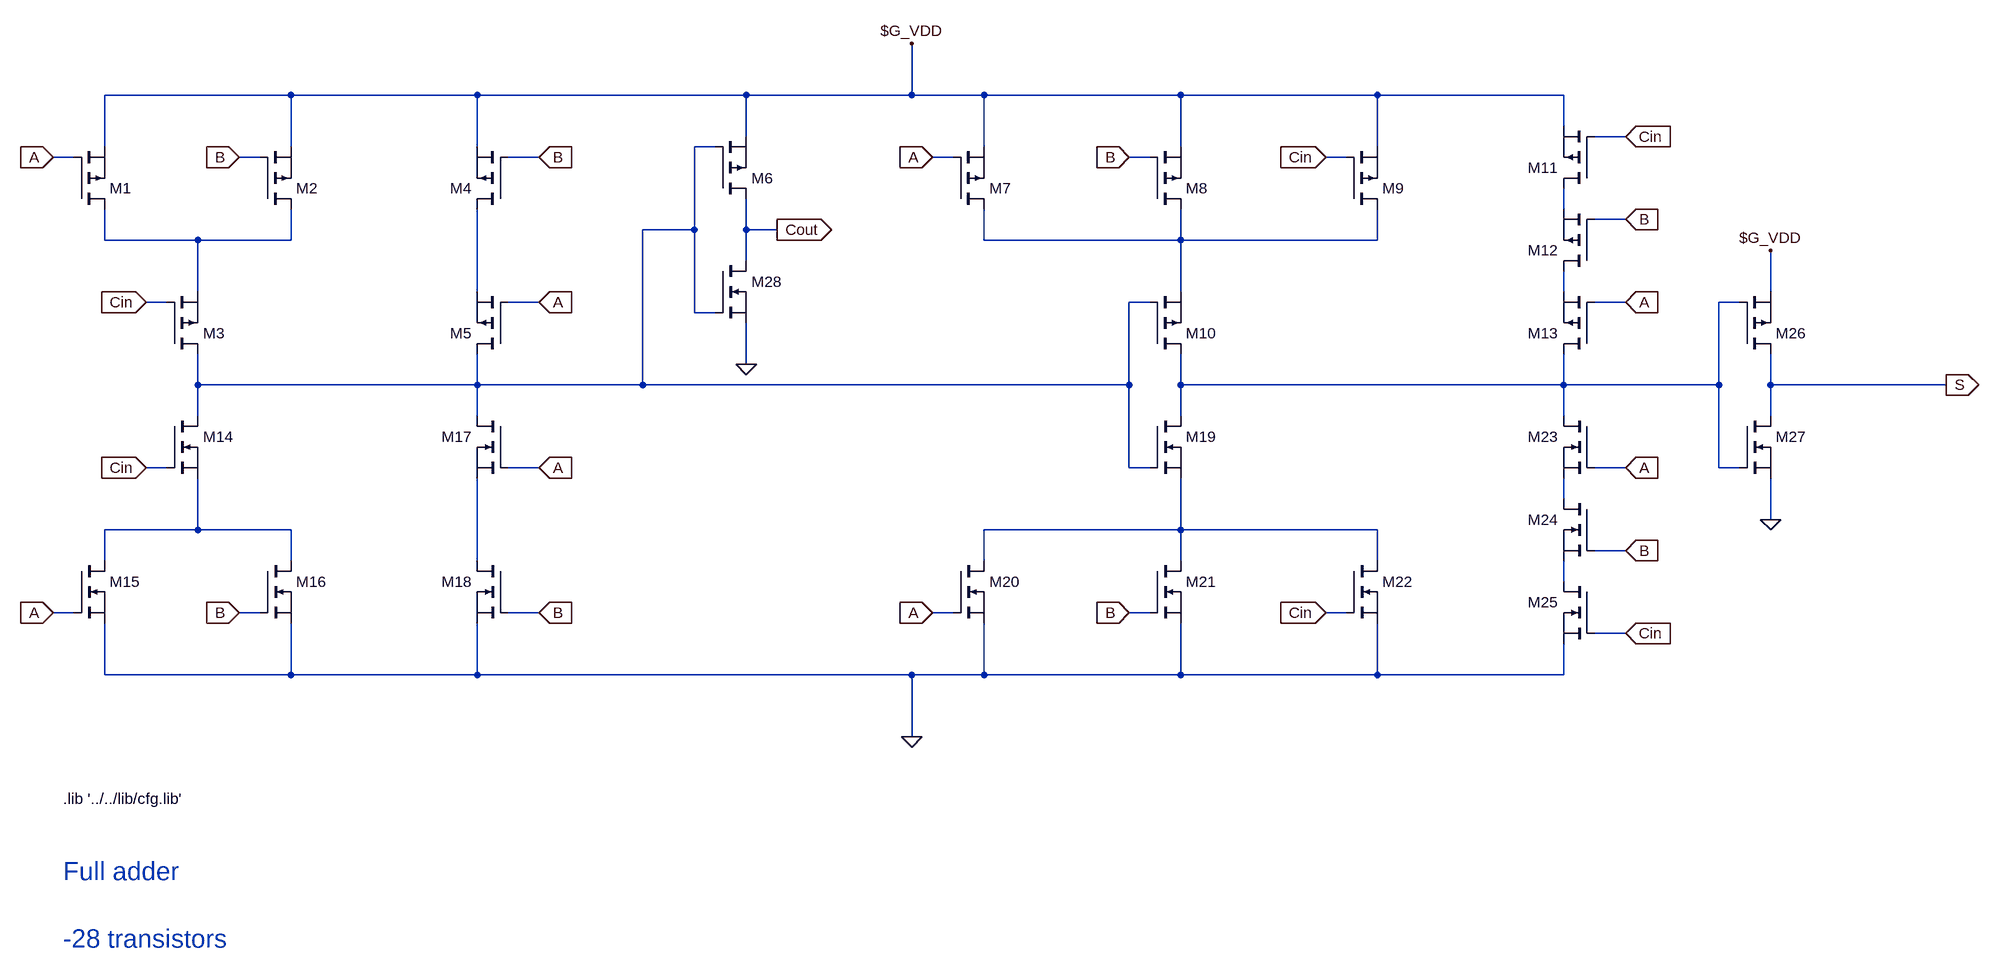
[diagram p0: schematic fa1.asc]
fa1.asc, the LTspice schematic file:
Version 4
SHEET 1 2652 1124
WIRE 16 -336 -272 -336
WIRE 304 -336 16 -336
WIRE 720 -336 304 -336
WIRE 976 -336 976 -416
WIRE 976 -336 720 -336
WIRE 1088 -336 976 -336
WIRE 1392 -336 1088 -336
WIRE 1696 -336 1392 -336
WIRE 1984 -336 1696 -336
WIRE 1984 -288 1984 -336
WIRE 720 -272 720 -336
WIRE 2080 -272 2032 -272
WIRE -272 -256 -272 -336
WIRE 16 -256 16 -336
WIRE 304 -256 304 -336
WIRE 672 -256 640 -256
WIRE 1088 -256 1088 -336
WIRE 1392 -256 1392 -336
WIRE 1696 -256 1696 -336
WIRE -320 -240 -352 -240
WIRE -32 -240 -64 -240
WIRE 400 -240 352 -240
WIRE 1040 -240 1008 -240
WIRE 1344 -240 1312 -240
WIRE 1648 -240 1616 -240
WIRE 1984 -160 1984 -192
WIRE 2080 -144 2032 -144
WIRE 640 -128 640 -256
WIRE 640 -128 560 -128
WIRE 720 -128 720 -176
WIRE 768 -128 720 -128
WIRE -272 -112 -272 -160
WIRE -128 -112 -272 -112
WIRE 16 -112 16 -160
WIRE 16 -112 -128 -112
WIRE 1088 -112 1088 -160
WIRE 1392 -112 1392 -160
WIRE 1392 -112 1088 -112
WIRE 1696 -112 1696 -160
WIRE 1696 -112 1392 -112
WIRE 720 -80 720 -128
WIRE -128 -32 -128 -112
WIRE 304 -32 304 -160
WIRE 1392 -32 1392 -112
WIRE 1984 -32 1984 -64
WIRE 2304 -32 2304 -96
WIRE -176 -16 -208 -16
WIRE 400 -16 352 -16
WIRE 1344 -16 1312 -16
WIRE 2080 -16 2032 -16
WIRE 2256 -16 2224 -16
WIRE 640 0 640 -128
WIRE 672 0 640 0
WIRE 720 80 720 16
WIRE -128 112 -128 64
WIRE 304 112 304 64
WIRE 304 112 -128 112
WIRE 560 112 560 -128
WIRE 560 112 304 112
WIRE 1312 112 1312 -16
WIRE 1312 112 560 112
WIRE 1392 112 1392 64
WIRE 1984 112 1984 64
WIRE 1984 112 1392 112
WIRE 2224 112 2224 -16
WIRE 2224 112 1984 112
WIRE 2304 112 2304 64
WIRE 2576 112 2304 112
WIRE -128 160 -128 112
WIRE 304 160 304 112
WIRE 1392 160 1392 112
WIRE 1984 160 1984 112
WIRE 2304 160 2304 112
WIRE -176 240 -208 240
WIRE 400 240 352 240
WIRE 1312 240 1312 112
WIRE 1344 240 1312 240
WIRE 2080 240 2032 240
WIRE 2224 240 2224 112
WIRE 2256 240 2224 240
WIRE 1984 288 1984 256
WIRE 2304 320 2304 256
WIRE -128 336 -128 256
WIRE -128 336 -272 336
WIRE 16 336 -128 336
WIRE 1392 336 1392 256
WIRE 1392 336 1088 336
WIRE 1696 336 1392 336
WIRE 2080 368 2032 368
WIRE -272 384 -272 336
WIRE 16 384 16 336
WIRE 304 384 304 256
WIRE 1088 384 1088 336
WIRE 1392 384 1392 336
WIRE 1696 384 1696 336
WIRE 1984 416 1984 384
WIRE -320 464 -352 464
WIRE -32 464 -64 464
WIRE 400 464 352 464
WIRE 1040 464 1008 464
WIRE 1344 464 1312 464
WIRE 1648 464 1616 464
WIRE 2080 496 2032 496
WIRE -272 560 -272 480
WIRE 16 560 16 480
WIRE 16 560 -272 560
WIRE 304 560 304 480
WIRE 304 560 16 560
WIRE 976 560 304 560
WIRE 1088 560 1088 480
WIRE 1088 560 976 560
WIRE 1392 560 1392 480
WIRE 1392 560 1088 560
WIRE 1696 560 1696 480
WIRE 1696 560 1392 560
WIRE 1984 560 1984 512
WIRE 1984 560 1696 560
WIRE 976 656 976 560
FLAG -352 -240 A
IOPIN -352 -240 In
FLAG -208 -16 Cin
IOPIN -208 -16 In
FLAG -64 -240 B
IOPIN -64 -240 In
FLAG 400 -240 B
IOPIN 400 -240 In
FLAG 400 -16 A
IOPIN 400 -16 In
FLAG -208 240 Cin
IOPIN -208 240 In
FLAG -352 464 A
IOPIN -352 464 In
FLAG -64 464 B
IOPIN -64 464 In
FLAG 400 240 A
IOPIN 400 240 In
FLAG 400 464 B
IOPIN 400 464 In
FLAG 768 -128 Cout
IOPIN 768 -128 Out
FLAG 720 80 0
FLAG 1008 -240 A
IOPIN 1008 -240 In
FLAG 1616 -240 Cin
IOPIN 1616 -240 In
FLAG 1008 464 A
IOPIN 1008 464 In
FLAG 1616 464 Cin
IOPIN 1616 464 In
FLAG 1312 -240 B
IOPIN 1312 -240 In
FLAG 1312 464 B
IOPIN 1312 464 In
FLAG 2080 -272 Cin
IOPIN 2080 -272 In
FLAG 2080 -144 B
IOPIN 2080 -144 In
FLAG 2080 -16 A
IOPIN 2080 -16 In
FLAG 2080 496 Cin
IOPIN 2080 496 In
FLAG 2080 368 B
IOPIN 2080 368 In
FLAG 2080 240 A
IOPIN 2080 240 In
FLAG 2576 112 S
IOPIN 2576 112 Out
FLAG 2304 -96 $G_VDD
FLAG 2304 320 0
FLAG 976 -416 $G_VDD
FLAG 976 656 0
SYMBOL pmos -320 -160 M180
WINDOW 3 56 72 Invisible 2
SYMATTR InstName M1
SYMATTR Value pmos_t2
SYMATTR Prefix X
SYMBOL pmos -32 -160 M180
WINDOW 3 56 72 Invisible 2
SYMATTR InstName M2
SYMATTR Value pmos_t2
SYMATTR Prefix X
SYMBOL pmos -176 64 M180
WINDOW 3 56 72 Invisible 2
SYMATTR InstName M3
SYMATTR Value pmos_t2
SYMATTR Prefix X
SYMBOL pmos 352 -160 R180
WINDOW 3 56 72 Invisible 2
SYMATTR InstName M4
SYMATTR Value pmos_t2
SYMATTR Prefix X
SYMBOL pmos 352 64 R180
WINDOW 3 56 72 Invisible 2
SYMATTR InstName M5
SYMATTR Value pmos_t2
SYMATTR Prefix X
SYMBOL pmos 672 -176 M180
WINDOW 3 56 72 Invisible 2
SYMATTR InstName M6
SYMATTR Value pmos_t2
SYMATTR Prefix X
SYMBOL pmos 1040 -160 M180
WINDOW 3 56 72 Invisible 2
SYMATTR InstName M7
SYMATTR Value pmos_t2
SYMATTR Prefix X
SYMBOL pmos 1344 -160 M180
WINDOW 3 56 72 Invisible 2
SYMATTR InstName M8
SYMATTR Value pmos_t2
SYMATTR Prefix X
SYMBOL pmos 1648 -160 M180
WINDOW 3 56 72 Invisible 2
SYMATTR InstName M9
SYMATTR Value pmos_t2
SYMATTR Prefix X
SYMBOL pmos 1344 64 M180
WINDOW 3 56 72 Invisible 2
SYMATTR InstName M10
SYMATTR Value pmos_t2
SYMATTR Prefix X
SYMBOL pmos 2032 -192 R180
WINDOW 3 56 72 Invisible 2
SYMATTR InstName M11
SYMATTR Value pmos_t2
SYMATTR Prefix X
SYMBOL pmos 2032 -64 R180
WINDOW 3 56 72 Invisible 2
SYMATTR InstName M12
SYMATTR Value pmos_t2
SYMATTR Prefix X
SYMBOL pmos 2032 64 R180
WINDOW 3 56 72 Invisible 2
SYMATTR InstName M13
SYMATTR Value pmos_t2
SYMATTR Prefix X
SYMBOL nmos -176 160 R0
WINDOW 3 56 72 Invisible 2
SYMATTR InstName M14
SYMATTR Value nmos_t2
SYMATTR Prefix X
SYMBOL nmos -320 384 R0
WINDOW 3 56 72 Invisible 2
SYMATTR InstName M15
SYMATTR Value nmos_t2
SYMATTR Prefix X
SYMBOL nmos -32 384 R0
WINDOW 3 56 72 Invisible 2
SYMATTR InstName M16
SYMATTR Value nmos_t2
SYMATTR Prefix X
SYMBOL nmos 352 160 M0
WINDOW 3 56 72 Invisible 2
SYMATTR InstName M17
SYMATTR Value nmos_t2
SYMATTR Prefix X
SYMBOL nmos 352 384 M0
WINDOW 3 56 72 Invisible 2
SYMATTR InstName M18
SYMATTR Value nmos_t2
SYMATTR Prefix X
SYMBOL nmos 1344 160 R0
WINDOW 3 56 72 Invisible 2
SYMATTR InstName M19
SYMATTR Value nmos_t2
SYMATTR Prefix X
SYMBOL nmos 1040 384 R0
WINDOW 3 56 72 Invisible 2
SYMATTR InstName M20
SYMATTR Value nmos_t2
SYMATTR Prefix X
SYMBOL nmos 1344 384 R0
WINDOW 3 56 72 Invisible 2
SYMATTR InstName M21
SYMATTR Value nmos_t2
SYMATTR Prefix X
SYMBOL nmos 1648 384 R0
WINDOW 3 56 72 Invisible 2
SYMATTR InstName M22
SYMATTR Value nmos_t2
SYMATTR Prefix X
SYMBOL nmos 2032 160 M0
WINDOW 3 56 72 Invisible 2
SYMATTR InstName M23
SYMATTR Value nmos_t2
SYMATTR Prefix X
SYMBOL nmos 2032 288 M0
WINDOW 3 56 72 Invisible 2
SYMATTR InstName M24
SYMATTR Value nmos_t2
SYMATTR Prefix X
SYMBOL nmos 2032 416 M0
WINDOW 3 56 72 Invisible 2
SYMATTR InstName M25
SYMATTR Value nmos_t2
SYMATTR Prefix X
SYMBOL pmos 2256 64 M180
WINDOW 3 56 72 Invisible 2
SYMATTR InstName M26
SYMATTR Value pmos_t2
SYMATTR Prefix X
SYMBOL nmos 2256 160 R0
WINDOW 3 56 72 Invisible 2
SYMATTR InstName M27
SYMATTR Value nmos_t2
SYMATTR Prefix X
SYMBOL nmos 672 -80 R0
WINDOW 3 56 72 Invisible 2
SYMATTR InstName M28
SYMATTR Value nmos_t2
SYMATTR Prefix X
TEXT -336 752 Left 2 !.lib '../../lib/cfg.lib'
TEXT -336 864 Left 4 ;Full adder\n \n-28 transistors

The netlist it stands for:
* fa1.asc
XM1 N003 A $G_VDD pmos_t2  ; pins D G S
XM2 N003 B $G_VDD pmos_t2  ; pins D G S
XM3 N001 Cin N003 pmos_t2  ; pins D G S
XM4 N005 B $G_VDD pmos_t2  ; pins D G S
XM5 N001 A N005 pmos_t2  ; pins D G S
XM6 Cout N001 $G_VDD pmos_t2  ; pins D G S
XM7 N004 A $G_VDD pmos_t2  ; pins D G S
XM8 N004 B $G_VDD pmos_t2  ; pins D G S
XM9 N004 Cin $G_VDD pmos_t2  ; pins D G S
XM10 N007 N001 N004 pmos_t2  ; pins D G S
XM11 N002 Cin $G_VDD pmos_t2  ; pins D G S
XM12 N006 B N002 pmos_t2  ; pins D G S
XM13 N007 A N006 pmos_t2  ; pins D G S
XM14 N001 Cin N009 nmos_t2  ; pins D G S
XM15 N009 A 0 nmos_t2  ; pins D G S
XM16 N009 B 0 nmos_t2  ; pins D G S
XM17 N001 A N011 nmos_t2  ; pins D G S
XM18 N011 B 0 nmos_t2  ; pins D G S
XM19 N007 N001 N010 nmos_t2  ; pins D G S
XM20 N010 A 0 nmos_t2  ; pins D G S
XM21 N010 B 0 nmos_t2  ; pins D G S
XM22 N010 Cin 0 nmos_t2  ; pins D G S
XM23 N007 A N008 nmos_t2  ; pins D G S
XM24 N008 B N012 nmos_t2  ; pins D G S
XM25 N012 Cin 0 nmos_t2  ; pins D G S
XM26 S N007 $G_VDD pmos_t2  ; pins D G S
XM27 S N007 0 nmos_t2  ; pins D G S
XM28 Cout N001 0 nmos_t2  ; pins D G S
.lib '../../lib/cfg.lib'
* Full adder
* -28 transistors
.backanno
.end